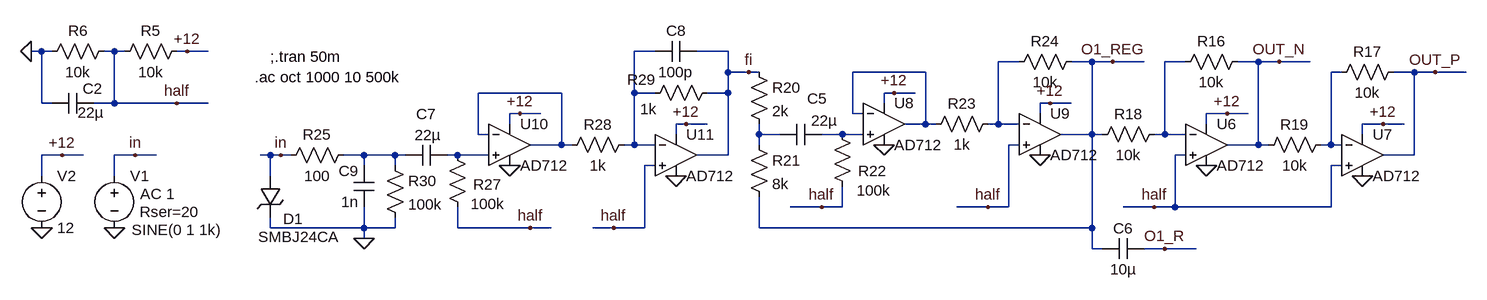
[diagram p0: schematic Volume_Control_02.asc]
Volume_Control_02.asc, the LTspice schematic file:
Version 4
SHEET 1 1804 816
WIRE -1152 416 -1168 416
WIRE -1136 416 -1152 416
WIRE -1040 416 -1056 416
WIRE -1024 416 -1040 416
WIRE -928 416 -944 416
WIRE -896 416 -928 416
WIRE -208 416 -240 416
WIRE -96 416 -144 416
WIRE 352 432 320 432
WIRE 464 432 432 432
WIRE 496 432 464 432
WIRE 544 432 496 432
WIRE 608 432 576 432
WIRE 720 432 688 432
WIRE 752 432 720 432
WIRE 800 432 752 432
WIRE -96 448 -96 416
WIRE -64 448 -96 448
WIRE -48 448 -64 448
WIRE 208 448 96 448
WIRE 848 448 832 448
WIRE 960 448 928 448
WIRE 992 448 960 448
WIRE 1040 448 992 448
WIRE -352 480 -480 480
WIRE -240 480 -240 416
WIRE -208 480 -240 480
WIRE -96 480 -96 448
WIRE -96 480 -128 480
WIRE 160 480 144 480
WIRE 192 480 160 480
WIRE -1152 496 -1152 416
WIRE -1136 496 -1152 496
WIRE -1040 496 -1040 416
WIRE -1040 496 -1072 496
WIRE -944 496 -1040 496
WIRE -896 496 -944 496
WIRE 144 496 144 480
WIRE 400 496 384 496
WIRE 432 496 400 496
WIRE -416 512 -432 512
WIRE -384 512 -416 512
WIRE 96 512 96 448
WIRE 112 512 96 512
WIRE 384 512 384 496
WIRE 672 512 640 512
WIRE 704 512 672 512
WIRE -432 528 -432 512
WIRE -160 528 -176 528
WIRE -128 528 -160 528
WIRE 208 528 208 448
WIRE 208 528 176 528
WIRE 224 528 208 528
WIRE 320 528 320 432
WIRE 320 528 304 528
WIRE 352 528 320 528
WIRE 640 528 640 512
WIRE 912 528 880 528
WIRE 944 528 912 528
WIRE -480 544 -480 480
WIRE -464 544 -480 544
WIRE -176 544 -176 528
WIRE -48 544 -48 528
WIRE -16 544 -48 544
WIRE 80 544 48 544
WIRE 112 544 80 544
WIRE 464 544 464 432
WIRE 464 544 416 544
WIRE 480 544 464 544
WIRE 576 544 576 432
WIRE 576 544 560 544
WIRE 608 544 576 544
WIRE 880 544 880 528
WIRE -352 560 -352 480
WIRE -352 560 -400 560
WIRE -336 560 -352 560
WIRE -240 560 -240 480
WIRE -240 560 -256 560
WIRE -208 560 -240 560
WIRE -48 560 -48 544
WIRE 352 560 336 560
WIRE 720 560 720 432
WIRE 720 560 672 560
WIRE 736 560 720 560
WIRE 832 560 832 448
WIRE 832 560 816 560
WIRE 848 560 832 560
WIRE -1120 576 -1152 576
WIRE -1088 576 -1120 576
WIRE -1008 576 -1040 576
WIRE -976 576 -1008 576
WIRE -800 576 -816 576
WIRE -784 576 -800 576
WIRE -768 576 -784 576
WIRE -656 576 -688 576
WIRE -608 576 -656 576
WIRE -592 576 -608 576
WIRE -512 576 -528 576
WIRE -464 576 -512 576
WIRE -96 576 -96 480
WIRE -96 576 -144 576
WIRE 608 576 592 576
WIRE 960 576 960 448
WIRE 960 576 912 576
WIRE -656 592 -656 576
WIRE -608 592 -608 576
WIRE -208 592 -224 592
WIRE 848 592 832 592
WIRE -1152 608 -1152 576
WIRE -1040 608 -1040 576
WIRE -800 608 -800 576
WIRE 48 656 0 656
WIRE 80 656 80 624
WIRE 80 656 48 656
WIRE 304 656 256 656
WIRE 336 656 336 560
WIRE 336 656 304 656
WIRE 560 656 512 656
WIRE 592 656 592 576
WIRE 592 656 560 656
WIRE 832 656 832 592
WIRE 832 656 592 656
WIRE -800 688 -800 672
WIRE -656 688 -656 656
WIRE -656 688 -800 688
WIRE -608 688 -608 672
WIRE -608 688 -656 688
WIRE -512 688 -512 656
WIRE -400 688 -512 688
WIRE -368 688 -400 688
WIRE -272 688 -304 688
WIRE -224 688 -224 592
WIRE -224 688 -272 688
WIRE -48 688 -48 640
WIRE 464 688 464 544
WIRE 464 688 -48 688
WIRE -656 704 -656 688
WIRE 464 720 464 688
WIRE 480 720 464 720
WIRE 576 720 544 720
WIRE 624 720 576 720
FLAG -1168 416 0
FLAG -1152 688 0
FLAG -1040 688 0
FLAG -1120 576 +12
FLAG -1008 576 in
FLAG -928 416 +12
FLAG 640 592 0
FLAG 880 608 0
FLAG 672 512 +12
FLAG 912 528 +12
FLAG 144 560 0
FLAG 384 576 0
FLAG 160 480 +12
FLAG 400 496 +12
FLAG -64 448 fi
FLAG 496 432 O1_REG
FLAG 752 432 OUT_N
FLAG 992 448 OUT_P
FLAG 576 720 O1_R
FLAG -432 592 0
FLAG -176 608 0
FLAG -416 512 +12
FLAG -160 528 +12
FLAG -784 576 in
FLAG -656 704 0
FLAG -400 688 half
FLAG -272 688 half
FLAG 48 656 half
FLAG 304 656 half
FLAG 560 656 half
FLAG -944 496 half
SYMBOL voltage -1040 592 R0
WINDOW 123 40 44 Left 2
WINDOW 39 39 71 Left 2
WINDOW 3 27 99 Left 2
SYMATTR Value2 AC 1
SYMATTR SpiceLine Rser=20
SYMATTR Value SINE(0 1 1k)
SYMATTR InstName V1
SYMBOL voltage -1152 592 R0
WINDOW 123 0 0 Left 0
WINDOW 39 0 0 Left 0
SYMATTR InstName V2
SYMATTR Value 12
SYMBOL res -928 400 R90
WINDOW 0 0 56 VBottom 2
WINDOW 3 32 56 VTop 2
SYMATTR InstName R5
SYMATTR Value 10k
SYMBOL res -1040 400 R90
WINDOW 0 0 56 VBottom 2
WINDOW 3 32 56 VTop 2
SYMATTR InstName R6
SYMATTR Value 10k
SYMBOL cap -1072 480 R90
WINDOW 0 9 1 VBottom 2
WINDOW 3 15 4 VTop 2
SYMATTR InstName C2
SYMATTR Value 22µ
SYMBOL res 704 416 R90
WINDOW 0 0 56 VBottom 2
WINDOW 3 32 56 VTop 2
SYMATTR InstName R16
SYMATTR Value 10k
SYMBOL res 944 432 R90
WINDOW 0 0 56 VBottom 2
WINDOW 3 32 56 VTop 2
SYMATTR InstName R17
SYMATTR Value 10k
SYMBOL res 576 528 R90
WINDOW 0 0 56 VBottom 2
WINDOW 3 32 56 VTop 2
SYMATTR InstName R18
SYMATTR Value 10k
SYMBOL res 832 544 R90
WINDOW 0 0 56 VBottom 2
WINDOW 3 32 56 VTop 2
SYMATTR InstName R19
SYMATTR Value 10k
SYMBOL OpAmps\\AD712 144 464 R0
SYMATTR InstName U8
SYMBOL OpAmps\\AD712 384 480 R0
SYMATTR InstName U9
SYMBOL cap 48 528 R90
WINDOW 0 -24 7 VBottom 2
WINDOW 3 -21 -4 VTop 2
SYMATTR InstName C5
SYMATTR Value 22µ
SYMBOL res -64 432 R0
SYMATTR InstName R20
SYMATTR Value 2k
SYMBOL res -64 544 R0
SYMATTR InstName R21
SYMATTR Value 8k
SYMBOL res 64 528 R0
WINDOW 0 40 72 Left 2
WINDOW 3 38 102 Left 2
SYMATTR InstName R22
SYMATTR Value 100k
SYMBOL res 320 512 R90
WINDOW 0 0 56 VBottom 2
WINDOW 3 32 56 VTop 2
SYMATTR InstName R23
SYMATTR Value 1k
SYMBOL res 448 416 R90
WINDOW 0 0 56 VBottom 2
WINDOW 3 32 56 VTop 2
SYMATTR InstName R24
SYMATTR Value 10k
SYMBOL cap 544 704 R90
WINDOW 0 0 32 VBottom 2
WINDOW 3 32 32 VTop 2
SYMATTR InstName C6
SYMATTR Value 10µ
SYMBOL OpAmps\\AD712 640 496 R0
SYMATTR InstName U6
SYMBOL OpAmps\\AD712 880 512 R0
SYMATTR InstName U7
SYMBOL OpAmps\\AD712 -432 496 R0
SYMATTR InstName U10
SYMBOL OpAmps\\AD712 -176 512 R0
SYMATTR InstName U11
SYMBOL cap -528 560 R90
WINDOW 0 -32 32 VBottom 2
WINDOW 3 -31 30 VTop 2
SYMATTR InstName C7
SYMATTR Value 22µ
SYMBOL res -528 560 R0
WINDOW 0 40 61 Left 2
WINDOW 3 36 91 Left 2
SYMATTR InstName R27
SYMATTR Value 100k
SYMBOL res -240 544 R90
WINDOW 0 0 56 VBottom 2
WINDOW 3 32 56 VTop 2
SYMATTR InstName R28
SYMATTR Value 1k
SYMBOL res -112 464 R90
WINDOW 0 11 117 VBottom 2
WINDOW 3 25 106 VTop 2
SYMATTR InstName R29
SYMATTR Value 1k
SYMBOL cap -144 400 R90
WINDOW 0 0 32 VBottom 2
WINDOW 3 32 32 VTop 2
SYMATTR InstName C8
SYMATTR Value 100p
SYMBOL res -624 576 R0
SYMATTR InstName R30
SYMATTR Value 100k
SYMBOL cap -640 656 R180
WINDOW 0 24 56 Left 2
WINDOW 3 24 8 Left 2
SYMATTR InstName C9
SYMATTR Value 1n
SYMBOL res -672 560 R90
WINDOW 0 0 56 VBottom 2
WINDOW 3 32 56 VTop 2
SYMATTR InstName R25
SYMATTR Value 100
SYMBOL TVSdiode -816 608 R0
WINDOW 0 36 66 Left 2
WINDOW 3 -3 94 Left 2
SYMATTR InstName D1
SYMATTR Value SMBJ24CA
SYMATTR Description Diode
SYMATTR Type diode
TEXT -800 424 Left 2 !;.tran 50m
TEXT -824 456 Left 2 !.ac oct 1000 10 500k

The netlist it stands for:
* Volume_Control_02.asc
V1 in 0 SINE(0 1 1k) AC 1 Rser=20
V2 +12 0 12
R5 +12 half 10k
R6 half 0 10k
C2 half 0 22µ
R16 OUT_N N003 10k
R17 OUT_P N005 10k
R18 N003 O1_REG 10k
R19 N005 OUT_N 10k
XU8 N008 N004 +12 0 N004 AD712  ; pins In+ In- V+ V- OUT
XU9 half N002 +12 0 O1_REG AD712  ; pins In+ In- V+ V- OUT
C5 N008 N007 22µ
R20 fi N007 2k
R21 N007 O1_REG 8k
R22 N008 half 100k
R23 N002 N004 1k
R24 O1_REG N002 10k
C6 O1_R O1_REG 10µ
XU6 half N003 +12 0 OUT_N AD712  ; pins In+ In- V+ V- OUT
XU7 half N005 +12 0 OUT_P AD712  ; pins In+ In- V+ V- OUT
XU10 N010 N006 +12 0 N006 AD712  ; pins In+ In- V+ V- OUT
XU11 half N001 +12 0 fi AD712  ; pins In+ In- V+ V- OUT
C7 N010 N009 22µ
R27 N010 half 100k
R28 N001 N006 1k
R29 fi N001 1k
C8 fi N001 100p
R30 N009 0 100k
C9 0 N009 1n
R25 N009 in 100
D1 in 0 SMBJ24CA
.model D D
.lib standard.dio
;.tran 50m
.ac oct 1000 10 500k
.backanno
.end